# Altium schematic sheet Sensor_Conjunto.SchDoc
size A4
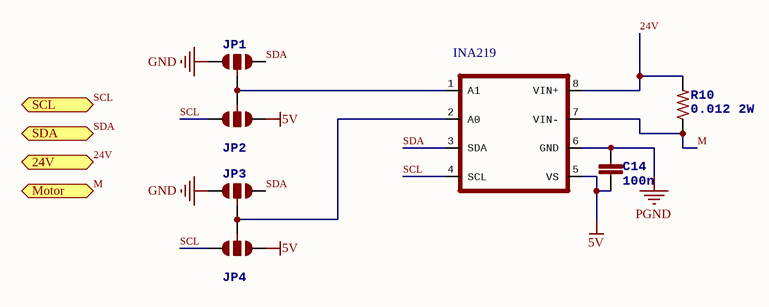
[diagram p0: Sensor_Conjunto.SchDoc]

## Parts
C14  100n  [0805]
IC1  INA219  [SO08]
JP1  JUMPER-PAD-3-NOYES_SILK  [PAD-JUMPER-3-NO_YES_SILK]  (value not drawn)
JP2  JUMPER-PAD-3-NOYES_SILK  [PAD-JUMPER-3-NO_YES_SILK]  (value not drawn)
JP3  JUMPER-PAD-3-NOYES_SILK  [PAD-JUMPER-3-NO_YES_SILK]  (value not drawn)
JP4  JUMPER-PAD-3-NOYES_SILK  [PAD-JUMPER-3-NO_YES_SILK]  (value not drawn)
R10  0.012 2W  [R2512]

## Ports
24V (in), Motor (out), SCL (in), SDA (in)

## Nets
5V: C14.1 IC1.5(VS) JP2.1 JP4.1
GND: JP1.1 JP3.1
PGND: C14.2 IC1.6(GND)
24V: IC1.8(VIN+) R10.2 ; port 24V
M: IC1.7(VIN-) R10.1 ; port Motor
SCL: IC1.4(SCL) JP2.3 JP4.3 ; port SCL
SDA: IC1.3(SDA) JP1.3 JP3.3 ; port SDA
NetIC1_1: IC1.1(A1) JP1.2 JP2.2
NetIC1_2: IC1.2(A0) JP3.2 JP4.2

## Library data of the parts
C14 = CAP0805
IC1 = INA219-SO8D
R10 = RESISTOR2512